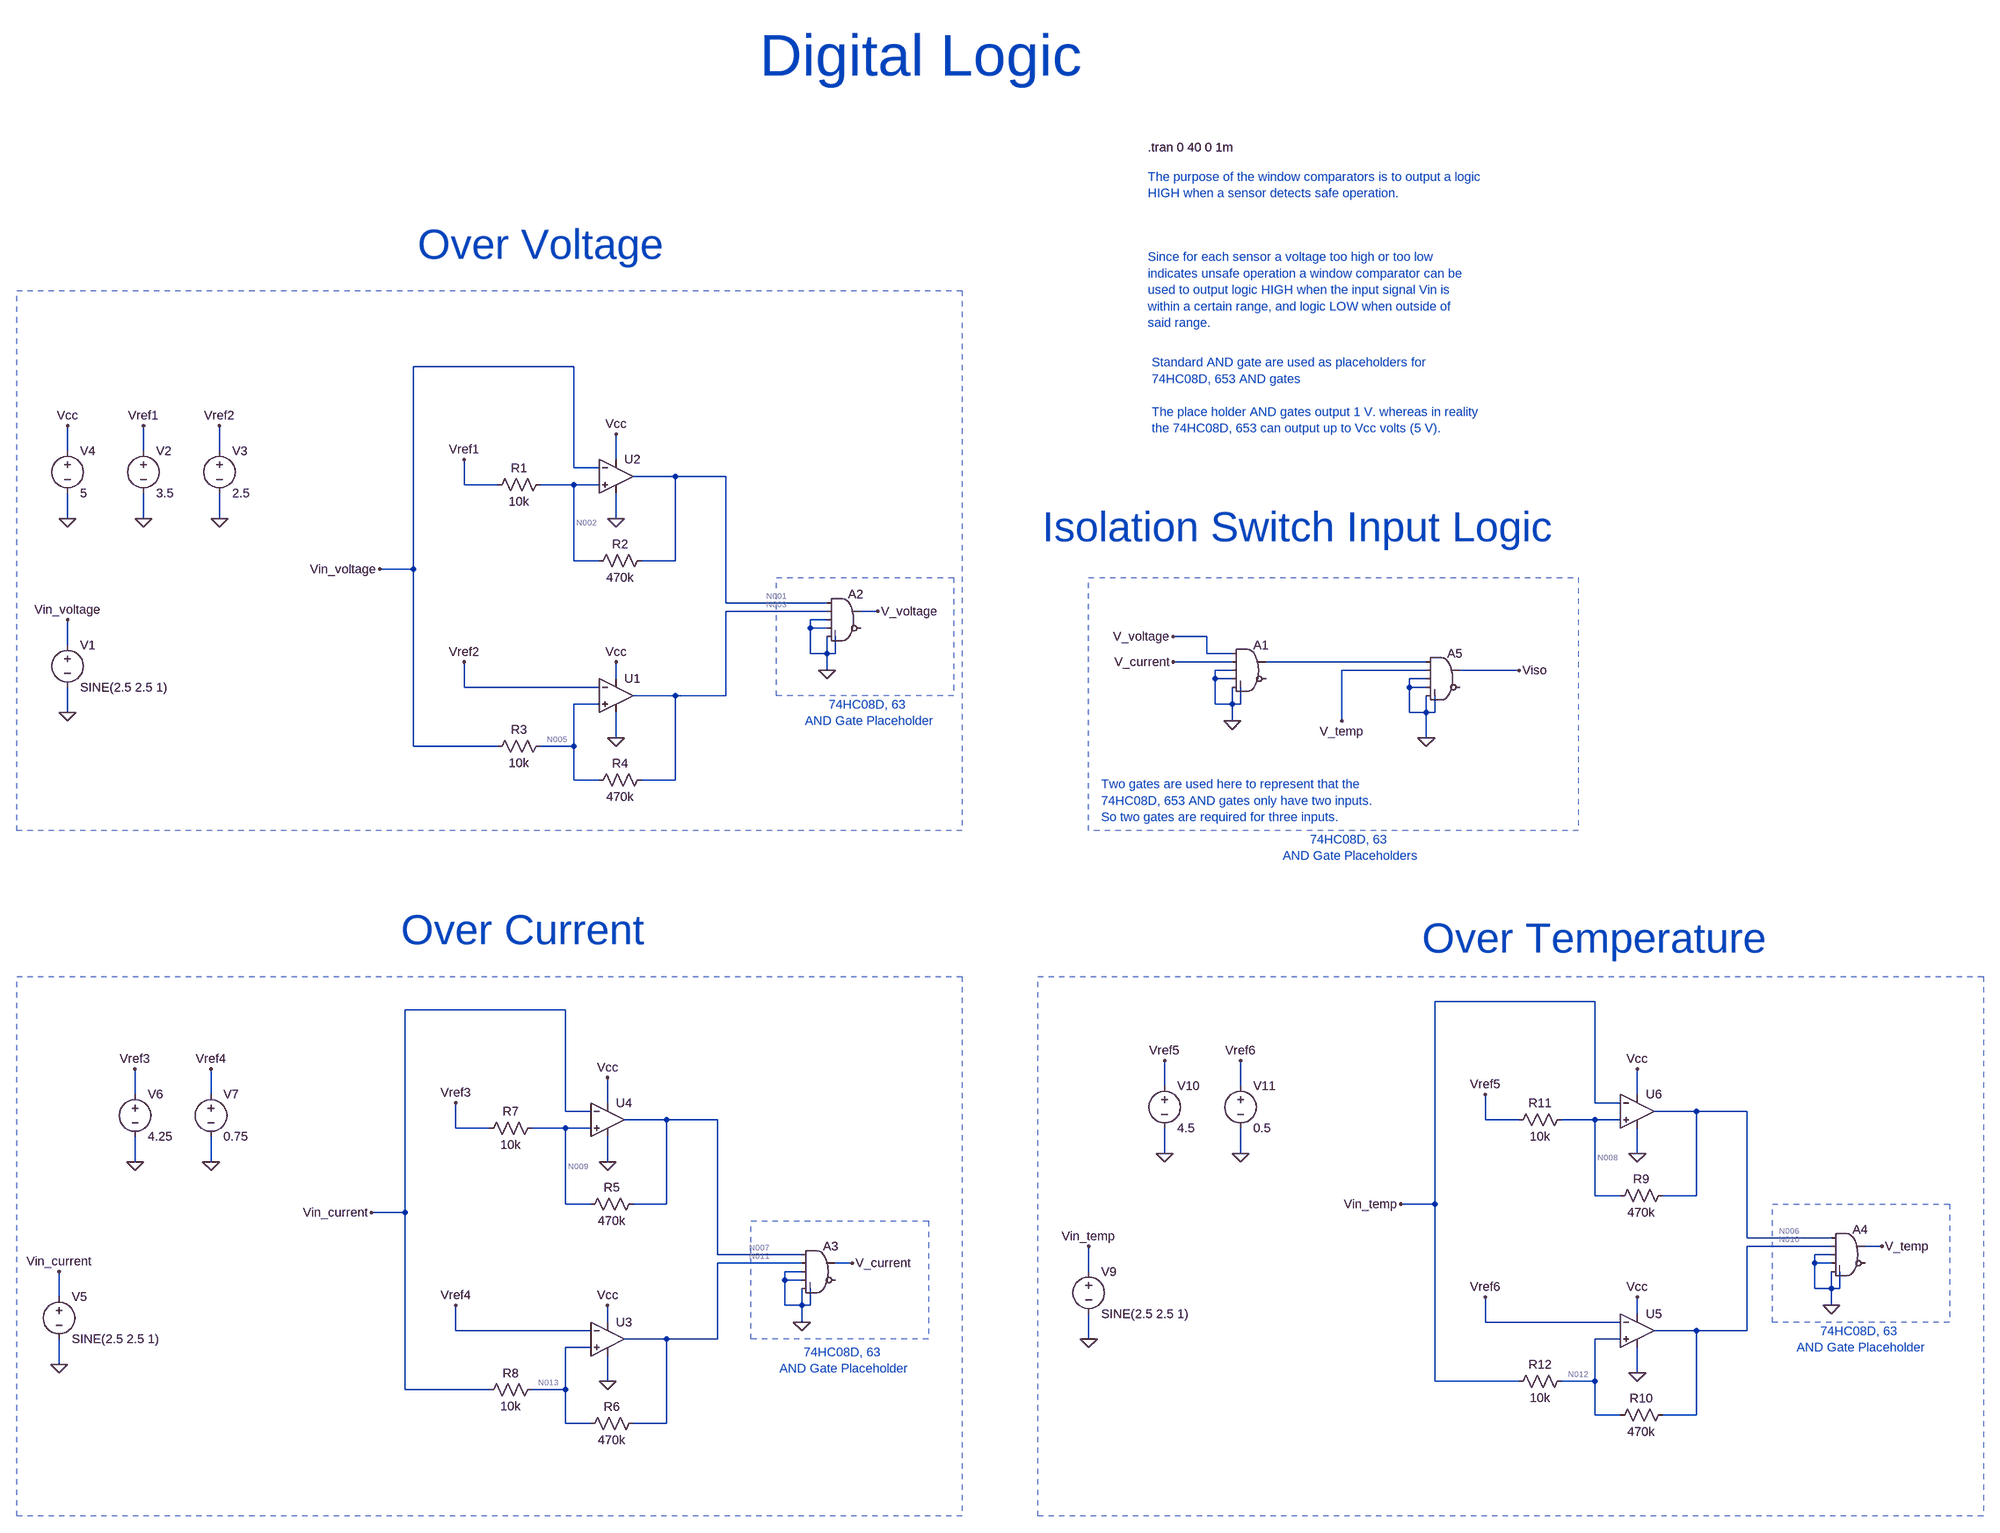
[diagram p0: schematic digital_logic.asc]
digital_logic.asc, the LTspice schematic file:
Version 4.1
SHEET 1 4908 2508
WIRE 144 -336 -160 -336
WIRE -816 -176 -816 -224
WIRE -672 -176 -672 -224
WIRE -528 -176 -528 -224
WIRE 224 -160 224 -208
WIRE 144 -144 144 -336
WIRE 192 -144 144 -144
WIRE 336 -128 256 -128
WIRE 432 -128 336 -128
WIRE -64 -112 -64 -160
WIRE 0 -112 -64 -112
WIRE 144 -112 80 -112
WIRE 192 -112 144 -112
WIRE -816 -48 -816 -96
WIRE -672 -48 -672 -96
WIRE -528 -48 -528 -96
WIRE 224 -48 224 -96
WIRE 144 32 144 -112
WIRE 192 32 144 32
WIRE 336 32 336 -128
WIRE 336 32 272 32
WIRE -160 48 -160 -336
WIRE -160 48 -224 48
WIRE 432 112 432 -128
WIRE 624 112 432 112
WIRE 624 128 432 128
WIRE 720 128 688 128
WIRE 624 144 592 144
WIRE 592 160 592 144
WIRE 624 160 592 160
WIRE 1344 176 1280 176
WIRE -816 192 -816 144
WIRE 592 208 592 160
WIRE 624 208 624 176
WIRE 624 208 592 208
WIRE 640 208 640 176
WIRE 640 208 624 208
WIRE 1344 208 1344 176
WIRE 1392 208 1344 208
WIRE 1392 224 1280 224
WIRE 1760 224 1456 224
WIRE 624 240 624 208
WIRE 1392 240 1360 240
WIRE 1760 240 1600 240
WIRE 1936 240 1824 240
WIRE 224 256 224 224
WIRE 1360 256 1360 240
WIRE 1392 256 1360 256
WIRE 1760 256 1728 256
WIRE -64 272 -64 224
WIRE 192 272 -64 272
WIRE 1728 272 1728 256
WIRE 1760 272 1728 272
WIRE 336 288 256 288
WIRE 432 288 432 128
WIRE 432 288 336 288
WIRE 192 304 144 304
WIRE 1360 304 1360 256
WIRE 1392 304 1392 272
WIRE 1392 304 1360 304
WIRE 1408 304 1408 272
WIRE 1408 304 1392 304
WIRE -816 320 -816 272
WIRE 1728 320 1728 272
WIRE 1760 320 1760 288
WIRE 1760 320 1728 320
WIRE 1776 320 1776 288
WIRE 1776 320 1760 320
WIRE 1392 336 1392 304
WIRE 1600 336 1600 240
WIRE 224 368 224 320
WIRE 1760 368 1760 320
WIRE -160 384 -160 48
WIRE 0 384 -160 384
WIRE 144 384 144 304
WIRE 144 384 80 384
WIRE 144 448 144 384
WIRE 192 448 144 448
WIRE 336 448 336 288
WIRE 336 448 272 448
WIRE 2080 880 1776 880
WIRE 128 896 -176 896
WIRE 1264 1040 1264 992
WIRE 1408 1040 1408 992
WIRE -688 1056 -688 1008
WIRE -544 1056 -544 1008
WIRE 2160 1056 2160 1008
WIRE 208 1072 208 1024
WIRE 2080 1072 2080 880
WIRE 2128 1072 2080 1072
WIRE 128 1088 128 896
WIRE 176 1088 128 1088
WIRE 2272 1088 2192 1088
WIRE 2368 1088 2272 1088
WIRE 320 1104 240 1104
WIRE 416 1104 320 1104
WIRE 1872 1104 1872 1056
WIRE 1936 1104 1872 1104
WIRE 2080 1104 2016 1104
WIRE 2128 1104 2080 1104
WIRE -80 1120 -80 1072
WIRE -16 1120 -80 1120
WIRE 128 1120 64 1120
WIRE 176 1120 128 1120
WIRE 1264 1168 1264 1120
WIRE 1408 1168 1408 1120
WIRE 2160 1168 2160 1120
WIRE -688 1184 -688 1136
WIRE -544 1184 -544 1136
WIRE 208 1184 208 1136
WIRE 2080 1248 2080 1104
WIRE 2128 1248 2080 1248
WIRE 2272 1248 2272 1088
WIRE 2272 1248 2208 1248
WIRE 128 1264 128 1120
WIRE 176 1264 128 1264
WIRE 320 1264 320 1104
WIRE 320 1264 256 1264
WIRE 1776 1264 1776 880
WIRE 1776 1264 1712 1264
WIRE -176 1280 -176 896
WIRE -176 1280 -240 1280
WIRE 2368 1328 2368 1088
WIRE 2528 1328 2368 1328
WIRE 2528 1344 2368 1344
WIRE 2624 1344 2592 1344
WIRE 416 1360 416 1104
WIRE 576 1360 416 1360
WIRE 2528 1360 2496 1360
WIRE 576 1376 416 1376
WIRE 672 1376 640 1376
WIRE 2496 1376 2496 1360
WIRE 2528 1376 2496 1376
WIRE 576 1392 544 1392
WIRE 1120 1392 1120 1344
WIRE 544 1408 544 1392
WIRE 576 1408 544 1408
WIRE 2496 1424 2496 1376
WIRE 2528 1424 2528 1392
WIRE 2528 1424 2496 1424
WIRE 2544 1424 2544 1392
WIRE 2544 1424 2528 1424
WIRE -832 1440 -832 1392
WIRE 544 1456 544 1408
WIRE 576 1456 576 1424
WIRE 576 1456 544 1456
WIRE 592 1456 592 1424
WIRE 592 1456 576 1456
WIRE 2528 1456 2528 1424
WIRE 2160 1472 2160 1440
WIRE 208 1488 208 1456
WIRE 576 1488 576 1456
WIRE 1872 1488 1872 1440
WIRE 2128 1488 1872 1488
WIRE -80 1504 -80 1456
WIRE 176 1504 -80 1504
WIRE 2272 1504 2192 1504
WIRE 2368 1504 2368 1344
WIRE 2368 1504 2272 1504
WIRE 320 1520 240 1520
WIRE 416 1520 416 1376
WIRE 416 1520 320 1520
WIRE 1120 1520 1120 1472
WIRE 2128 1520 2080 1520
WIRE 176 1536 128 1536
WIRE -832 1568 -832 1520
WIRE 2160 1584 2160 1536
WIRE 208 1600 208 1552
WIRE 1776 1600 1776 1264
WIRE 1936 1600 1776 1600
WIRE 2080 1600 2080 1520
WIRE 2080 1600 2016 1600
WIRE -176 1616 -176 1280
WIRE -16 1616 -176 1616
WIRE 128 1616 128 1536
WIRE 128 1616 64 1616
WIRE 2080 1664 2080 1600
WIRE 2128 1664 2080 1664
WIRE 2272 1664 2272 1504
WIRE 2272 1664 2208 1664
WIRE 128 1680 128 1616
WIRE 176 1680 128 1680
WIRE 320 1680 320 1520
WIRE 320 1680 256 1680
FLAG 224 368 0
FLAG 224 -48 0
FLAG -816 320 0
FLAG -672 -48 0
FLAG -528 -48 0
FLAG -816 144 Vin_voltage
FLAG -672 -224 Vref1
FLAG -528 -224 Vref2
FLAG -816 -48 0
FLAG -816 -224 Vcc
FLAG 224 -208 Vcc
FLAG 224 224 Vcc
FLAG -64 -160 Vref1
FLAG -64 224 Vref2
FLAG 208 1600 0
FLAG 208 1184 0
FLAG -832 1568 0
FLAG -688 1184 0
FLAG -544 1184 0
FLAG -832 1392 Vin_current
FLAG -688 1008 Vref3
FLAG -544 1008 Vref4
FLAG 208 1024 Vcc
FLAG 208 1456 Vcc
FLAG -80 1072 Vref3
FLAG -80 1456 Vref4
FLAG 2160 1584 0
FLAG 2160 1168 0
FLAG 1120 1520 0
FLAG 1264 1168 0
FLAG 1408 1168 0
FLAG 1120 1344 Vin_temp
FLAG 1264 992 Vref5
FLAG 1408 992 Vref6
FLAG 2160 1008 Vcc
FLAG 2160 1440 Vcc
FLAG 1872 1056 Vref5
FLAG 1872 1440 Vref6
FLAG -224 48 Vin_voltage
FLAG -240 1280 Vin_current
FLAG 1712 1264 Vin_temp
FLAG 1392 336 0
FLAG 1280 176 V_voltage
FLAG 1280 224 V_current
FLAG 1600 336 V_temp
FLAG 624 240 0
FLAG 720 128 V_voltage
FLAG 576 1488 0
FLAG 672 1376 V_current
FLAG 2528 1456 0
FLAG 2624 1344 V_temp
FLAG 1760 368 0
FLAG 1936 240 Viso
SYMBOL OpAmps\\UniversalOpAmp2 224 288 R0
SYMATTR InstName U1
SYMBOL OpAmps\\UniversalOpAmp2 224 -128 R0
SYMATTR InstName U2
SYMBOL voltage -816 176 R0
WINDOW 123 0 0 Left 0
WINDOW 39 0 0 Left 0
SYMATTR InstName V1
SYMATTR Value SINE(2.5 2.5 1)
SYMBOL voltage -672 -192 R0
WINDOW 123 0 0 Left 0
WINDOW 39 0 0 Left 0
SYMATTR InstName V2
SYMATTR Value 3.5
SYMBOL voltage -528 -192 R0
WINDOW 123 0 0 Left 0
WINDOW 39 0 0 Left 0
SYMATTR InstName V3
SYMATTR Value 2.5
SYMBOL res 288 16 R90
WINDOW 0 0 56 VBottom 2
WINDOW 3 32 56 VTop 2
SYMATTR InstName R2
SYMATTR Value 470k
SYMBOL res 288 432 R90
WINDOW 0 0 56 VBottom 2
WINDOW 3 32 56 VTop 2
SYMATTR InstName R4
SYMATTR Value 470k
SYMBOL voltage -816 -192 R0
WINDOW 123 0 0 Left 0
WINDOW 39 0 0 Left 0
SYMATTR InstName V4
SYMATTR Value 5
SYMBOL res 96 -128 R90
WINDOW 0 0 56 VBottom 2
WINDOW 3 32 56 VTop 2
SYMATTR InstName R1
SYMATTR Value 10k
SYMBOL res 96 368 R90
WINDOW 0 0 56 VBottom 2
WINDOW 3 32 56 VTop 2
SYMATTR InstName R3
SYMATTR Value 10k
SYMBOL OpAmps\\UniversalOpAmp2 208 1520 R0
SYMATTR InstName U3
SYMBOL OpAmps\\UniversalOpAmp2 208 1104 R0
SYMATTR InstName U4
SYMBOL voltage -832 1424 R0
WINDOW 123 0 0 Left 0
WINDOW 39 0 0 Left 0
SYMATTR InstName V5
SYMATTR Value SINE(2.5 2.5 1)
SYMBOL voltage -688 1040 R0
WINDOW 123 0 0 Left 0
WINDOW 39 0 0 Left 0
SYMATTR InstName V6
SYMATTR Value 4.25
SYMBOL voltage -544 1040 R0
WINDOW 123 0 0 Left 0
WINDOW 39 0 0 Left 0
SYMATTR InstName V7
SYMATTR Value 0.75
SYMBOL res 272 1248 R90
WINDOW 0 0 56 VBottom 2
WINDOW 3 32 56 VTop 2
SYMATTR InstName R5
SYMATTR Value 470k
SYMBOL res 272 1664 R90
WINDOW 0 0 56 VBottom 2
WINDOW 3 32 56 VTop 2
SYMATTR InstName R6
SYMATTR Value 470k
SYMBOL res 80 1104 R90
WINDOW 0 0 56 VBottom 2
WINDOW 3 32 56 VTop 2
SYMATTR InstName R7
SYMATTR Value 10k
SYMBOL res 80 1600 R90
WINDOW 0 0 56 VBottom 2
WINDOW 3 32 56 VTop 2
SYMATTR InstName R8
SYMATTR Value 10k
SYMBOL OpAmps\\UniversalOpAmp2 2160 1504 R0
SYMATTR InstName U5
SYMBOL OpAmps\\UniversalOpAmp2 2160 1088 R0
SYMATTR InstName U6
SYMBOL voltage 1120 1376 R0
WINDOW 123 0 0 Left 0
WINDOW 39 0 0 Left 0
SYMATTR InstName V9
SYMATTR Value SINE(2.5 2.5 1)
SYMBOL voltage 1264 1024 R0
WINDOW 123 0 0 Left 0
WINDOW 39 0 0 Left 0
SYMATTR InstName V10
SYMATTR Value 4.5
SYMBOL voltage 1408 1024 R0
WINDOW 123 0 0 Left 0
WINDOW 39 0 0 Left 0
SYMATTR InstName V11
SYMATTR Value 0.5
SYMBOL res 2224 1232 R90
WINDOW 0 0 56 VBottom 2
WINDOW 3 32 56 VTop 2
SYMATTR InstName R9
SYMATTR Value 470k
SYMBOL res 2224 1648 R90
WINDOW 0 0 56 VBottom 2
WINDOW 3 32 56 VTop 2
SYMATTR InstName R10
SYMATTR Value 470k
SYMBOL res 2032 1088 R90
WINDOW 0 0 56 VBottom 2
WINDOW 3 32 56 VTop 2
SYMATTR InstName R11
SYMATTR Value 10k
SYMBOL res 2032 1584 R90
WINDOW 0 0 56 VBottom 2
WINDOW 3 32 56 VTop 2
SYMATTR InstName R12
SYMATTR Value 10k
SYMBOL Digital\\and 1424 176 R0
SYMATTR InstName A1
SYMBOL Digital\\and 656 80 R0
SYMATTR InstName A2
SYMBOL Digital\\and 608 1328 R0
SYMATTR InstName A3
SYMBOL Digital\\and 2560 1296 R0
SYMATTR InstName A4
SYMBOL Digital\\and 1792 192 R0
SYMATTR InstName A5
TEXT 1232 -752 Left 2 !.tran 0 40 0 1m
TEXT 1232 -544 Left 2 ;Since for each sensor a voltage too high or too low \nindicates unsafe operation a window comparator can be \nused to output logic HIGH when the input signal Vin is \nwithin a certain range, and logic LOW when outside of \nsaid range.
TEXT 1232 -696 Left 2 ;The purpose of the window comparators is to output a logic\nHIGH when a sensor detects safe operation.
TEXT -152 -568 Left 6 ;Over Voltage
TEXT -184 744 Left 6 ;Over Current
TEXT 1752 760 Left 6 ;Over Temperature
TEXT 496 -1000 Left 7 ;Digital Logic
TEXT 704 320 Center 2 ;74HC08D, 63 \nAND Gate Placeholder
TEXT 656 1560 Center 2 ;74HC08D, 63 \nAND Gate Placeholder
TEXT 2584 1520 Center 2 ;74HC08D, 63 \nAND Gate Placeholder
TEXT 1032 -32 Left 6 ;Isolation Switch Input Logic
TEXT 1616 576 Center 2 ;74HC08D, 63 \nAND Gate Placeholders
TEXT 1240 -344 Left 2 ;Standard AND gate are used as placeholders for\n74HC08D, 653 AND gates\n \nThe place holder AND gates output 1 V. whereas in reality\nthe 74HC08D, 653 can output up to Vcc volts (5 V).
TEXT 1144 456 Left 2 ;Two gates are used here to represent that the\n74HC08D, 653 AND gates only have two inputs.\nSo two gates are required for three inputs.
RECTANGLE Normal 880 544 -912 -480 2
RECTANGLE Normal 880 1856 -912 832 2
RECTANGLE Normal 2816 1856 1024 832 2
RECTANGLE Normal 864 288 528 64 2
RECTANGLE Normal 816 1520 480 1296 2
RECTANGLE Normal 2752 1488 2416 1264 2
RECTANGLE Normal 2048 544 1120 64 2

The netlist it stands for:
* digital_logic.asc
X§U1 N005 Vref2 Vcc 0 N003 level2 Avol=1Meg GBW=10Meg Slew=10Meg Ilimit=25m Rail=0 Vos=0 En=0 Enk=0 In=0 Ink=0 Rin=500Meg  ; pins In+ In- V+ V- OUT
X§U2 N002 Vin_voltage Vcc 0 N001 level2 Avol=1Meg GBW=10Meg Slew=10Meg Ilimit=25m Rail=0 Vos=0 En=0 Enk=0 In=0 Ink=0 Rin=500Meg  ; pins In+ In- V+ V- OUT
V1 Vin_voltage 0 SINE(2.5 2.5 1)
V2 Vref1 0 3.5
V3 Vref2 0 2.5
R2 N001 N002 470k
R4 N003 N005 470k
V4 Vcc 0 5
R1 N002 Vref1 10k
R3 N005 Vin_voltage 10k
X§U3 N013 Vref4 Vcc 0 N011 level2 Avol=1Meg GBW=10Meg Slew=10Meg Ilimit=25m Rail=0 Vos=0 En=0 Enk=0 In=0 Ink=0 Rin=500Meg  ; pins In+ In- V+ V- OUT
X§U4 N009 Vin_current Vcc 0 N007 level2 Avol=1Meg GBW=10Meg Slew=10Meg Ilimit=25m Rail=0 Vos=0 En=0 Enk=0 In=0 Ink=0 Rin=500Meg  ; pins In+ In- V+ V- OUT
V5 Vin_current 0 SINE(2.5 2.5 1)
V6 Vref3 0 4.25
V7 Vref4 0 0.75
R5 N007 N009 470k
R6 N011 N013 470k
R7 N009 Vref3 10k
R8 N013 Vin_current 10k
X§U5 N012 Vref6 Vcc 0 N010 level2 Avol=1Meg GBW=10Meg Slew=10Meg Ilimit=25m Rail=0 Vos=0 En=0 Enk=0 In=0 Ink=0 Rin=500Meg  ; pins In+ In- V+ V- OUT
X§U6 N008 Vin_temp Vcc 0 N006 level2 Avol=1Meg GBW=10Meg Slew=10Meg Ilimit=25m Rail=0 Vos=0 En=0 Enk=0 In=0 Ink=0 Rin=500Meg  ; pins In+ In- V+ V- OUT
V9 Vin_temp 0 SINE(2.5 2.5 1)
V10 Vref5 0 4.5
V11 Vref6 0 0.5
R9 N006 N008 470k
R10 N010 N012 470k
R11 N008 Vref5 10k
R12 N012 Vin_temp 10k
A1 V_voltage V_current 0 0 0 0 N004 0 AND
A2 N001 N003 0 0 0 0 V_voltage 0 AND
A3 N007 N011 0 0 0 0 V_current 0 AND
A4 N006 N010 0 0 0 0 V_temp 0 AND
A5 N004 V_temp 0 0 0 0 Viso 0 AND
.tran 0 40 0 1m
* Since for each sensor a voltage too high or too low
* indicates unsafe operation a window comparator can be
* used to output logic HIGH when the input signal Vin is
* within a certain range, and logic LOW when outside of
* said range.
* The purpose of the window comparators is to output a logic
* HIGH when a sensor detects safe operation.
* Over Voltage
* Over Current
* Over Temperature
* Digital Logic
* 74HC08D, 63
* AND Gate Placeholder
* 74HC08D, 63
* AND Gate Placeholder
* 74HC08D, 63
* AND Gate Placeholder
* Isolation Switch Input Logic
* 74HC08D, 63
* AND Gate Placeholders
* Standard AND gate are used as placeholders for
* 74HC08D, 653 AND gates
* The place holder AND gates output 1 V. whereas in reality
* the 74HC08D, 653 can output up to Vcc volts (5 V).
* Two gates are used here to represent that the
* 74HC08D, 653 AND gates only have two inputs.
* So two gates are required for three inputs.
.lib UniversalOpAmp2.lib
.backanno
.end

* Results of the author's LTspice run, read from the files saved beside the schematic
* Operating Point, zero values left out:
*   V(n001) = 5 V
*   V(n002) = 3.531 V
*   V(n003) = 61.1 µV
*   V(n005) = 2.448 V
*   V(n006) = 5 V
*   V(n007) = 5 V
*   V(n008) = 4.51 V
*   V(n009) = 4.266 V
*   V(n010) = 5 V
*   V(n011) = 5 V
*   V(n012) = 2.552 V
*   V(n013) = 2.552 V
*   V(v_current) = 1 V
*   V(v_temp) = 1 V
*   V(vcc) = 5 V
*   V(vin_current) = 2.5 V
*   V(vin_temp) = 2.5 V
*   V(vin_voltage) = 2.5 V
*   V(vref1) = 3.5 V
*   V(vref2) = 2.5 V
*   V(vref3) = 4.25 V
*   V(vref4) = 750 mV
*   V(vref5) = 4.5 V
*   V(vref6) = 500 mV
*   I(R1) = 3.123 µA
*   I(R10) = 5.208 µA
*   I(R11) = 1.038 µA
*   I(R12) = 5.208 µA
*   I(R2) = 3.125 µA
*   I(R3) = -5.208 µA
*   I(R4) = -5.208 µA
*   I(R5) = 1.563 µA
*   I(R6) = 5.208 µA
*   I(R7) = 1.559 µA
*   I(R8) = 5.208 µA
*   I(R9) = 1.042 µA
*   I(V1) = -5.208 µA
*   I(V10) = 1.038 µA
*   I(V11) = 4 nA
*   I(V2) = 3.123 µA
*   I(V4) = -19.04 µA
*   I(V5) = 5.208 µA
*   I(V6) = 1.559 µA
*   I(V7) = 3.5 nA
*   I(V9) = 5.208 µA